# EasyEDA Pro project ProPrj_esp32_pressure_sensor_2026-01-26.epro

# Schematic Main_Schematic
Board Name: ESP32_Pressure_Sensor; Create Date: 2026-01-04; Page Name: P1; Project Name: esp32_pressure_sensor; Schematic Name: Main_Schematic; Update Date: 2026-01-26; Company: EasyEDA.com; Page Size: A4; Version: V1.0
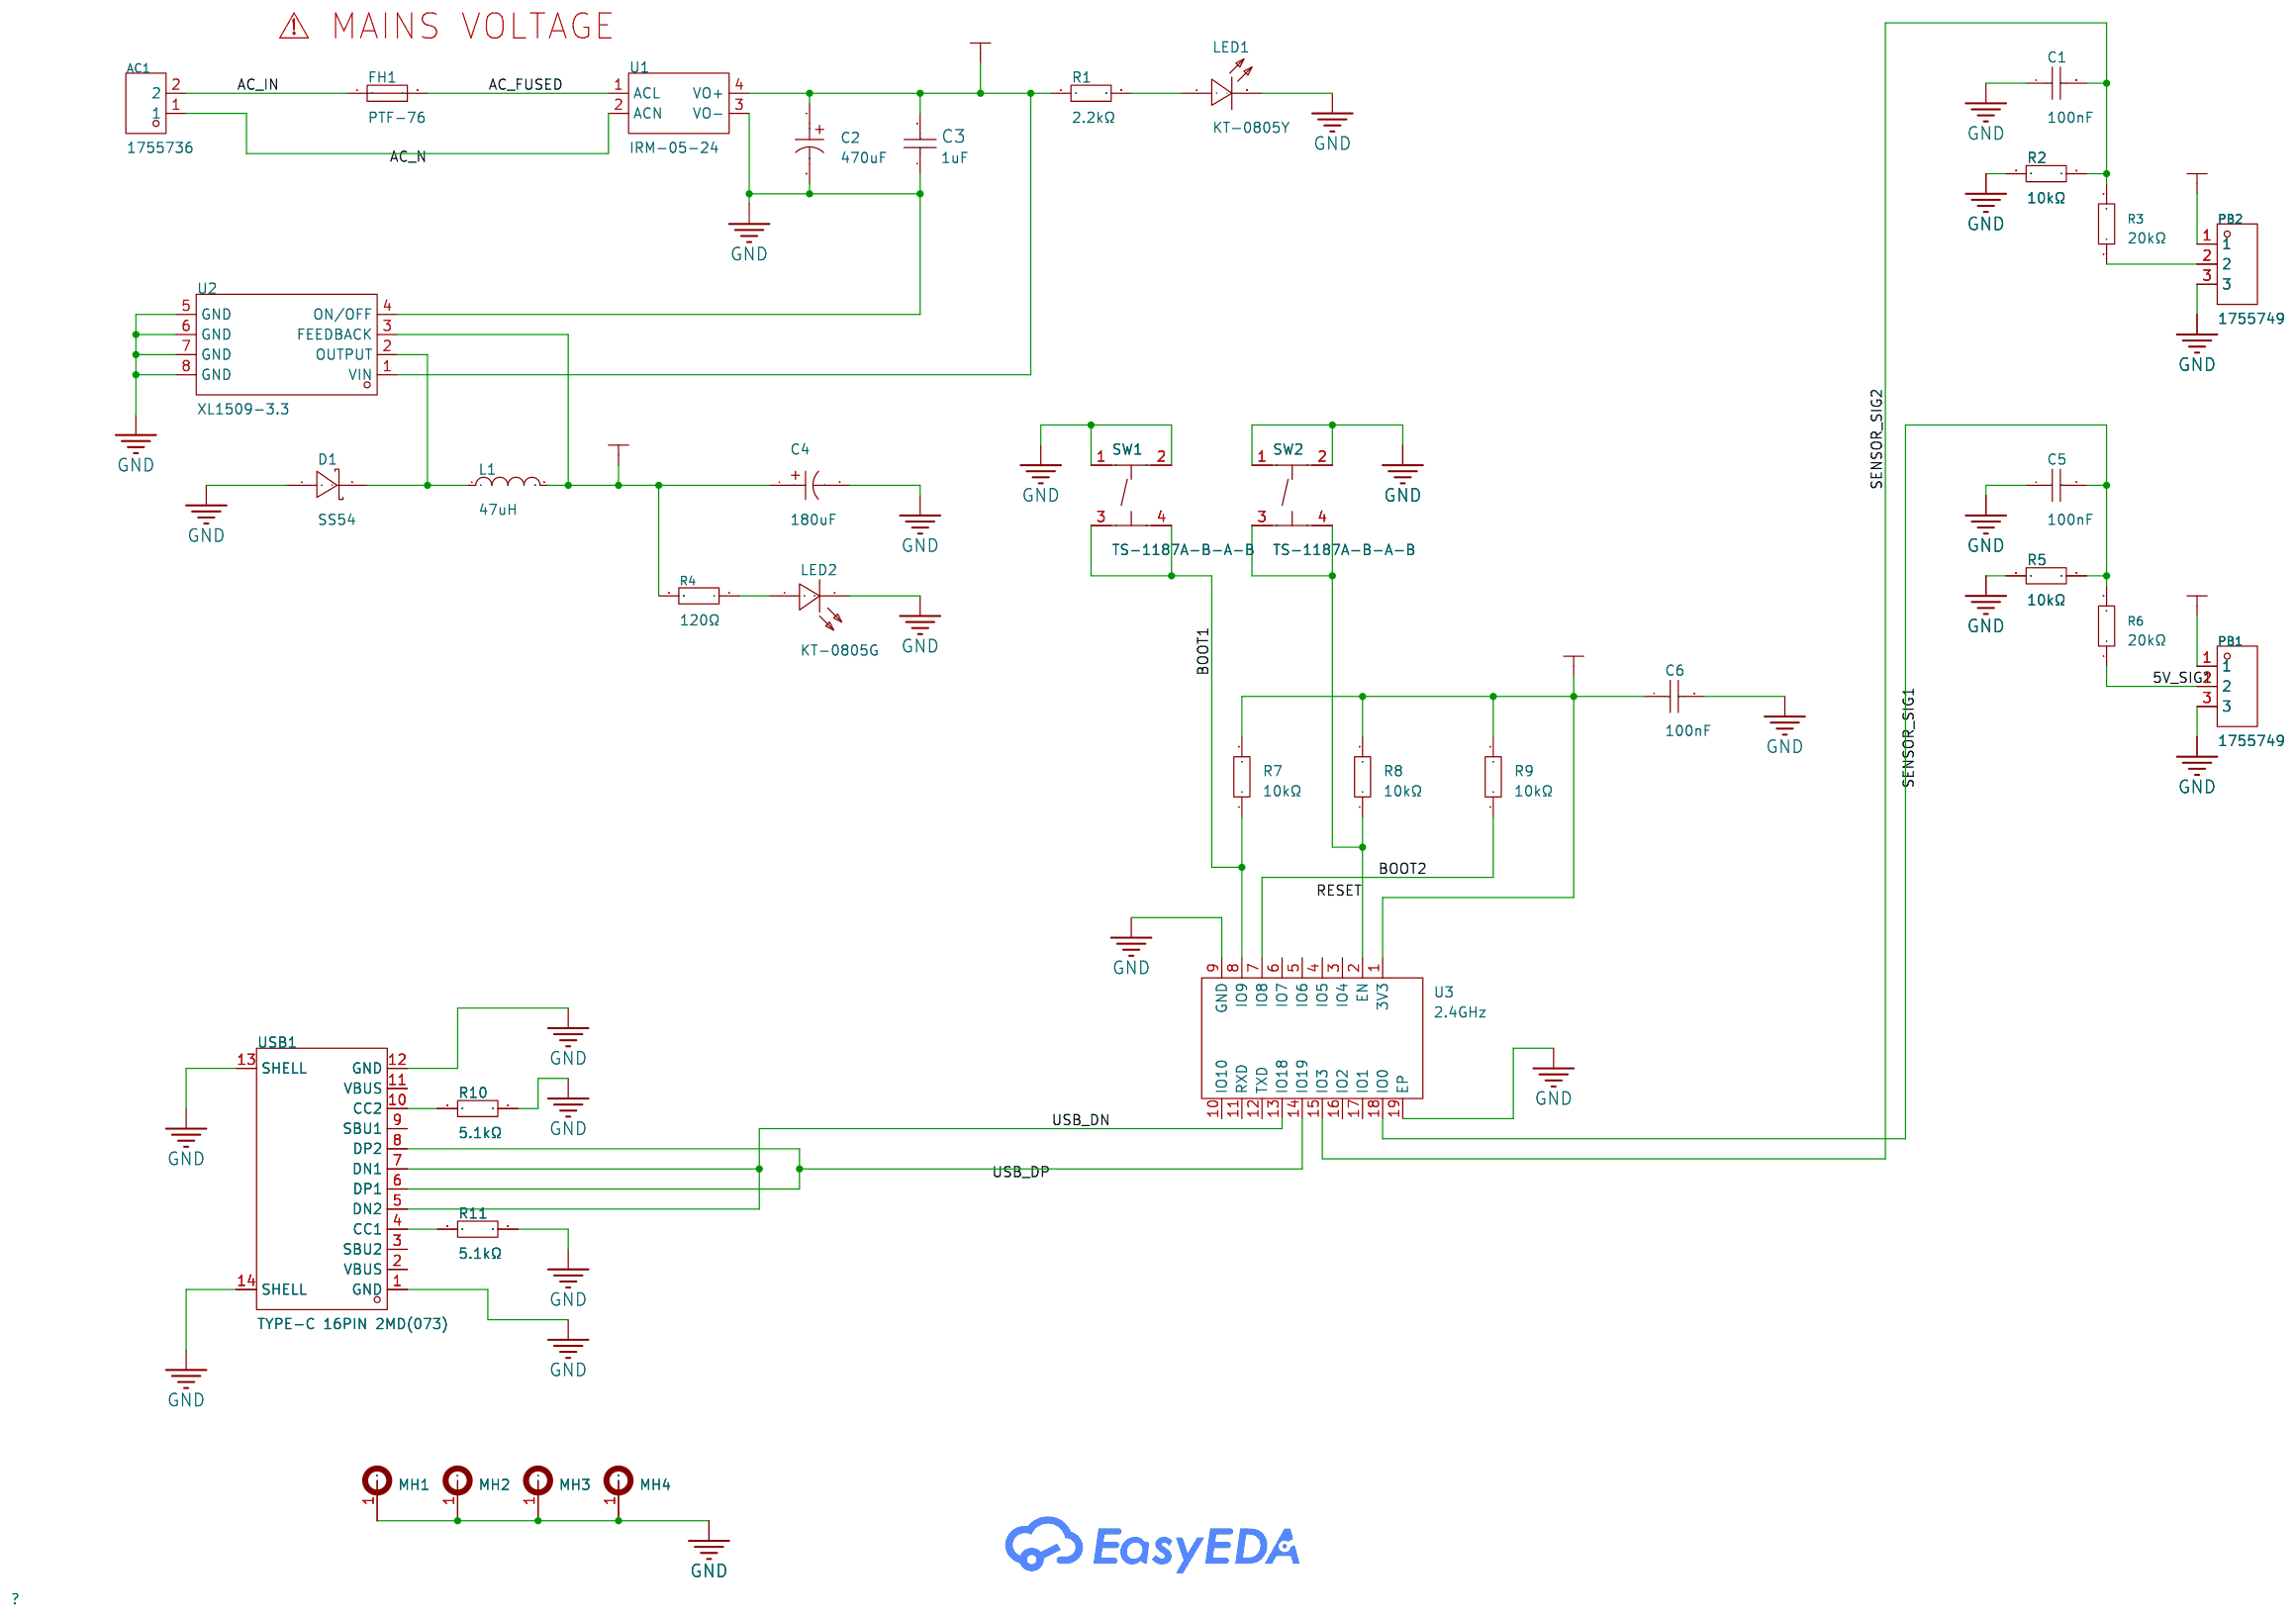
[diagram p0: schematic sheet]

## Parts
AC1  1755736  [CONN-TH_1755736]
C1  100nF  [C0805]
C2  470uF  [CAP-SMD_BD10.0-L10.3-W10.3-LS11.0-FD]
C3  1uF  [C0805]
C4  180uF  [CAP-SMD_BD6.3-L6.6-W6.6-LS7.4-FD]
C5  100nF  [C0805]
C6  100nF  [C0805]
D1  SS54  [SMA_L4.4-W2.8-LS5.4-R-RD]
FH1  PTF-76  [FUSE-TH_L25.2-W9.8_PTF-76]
L1  47uH  [IND-SMD_L4.5-W4.0]
LED1  KT-0805Y  [LED0805-R-RD]
LED2  KT-0805G  [LED0805-R-RD]
MH1  -  [MH_7.5x2.7mm]  (no BOM)
MH2  -  [MH_7.5x2.7mm]  (no BOM)
MH3  -  [MH_7.5x2.7mm]  (no BOM)
MH4  -  [MH_7.5x2.7mm]  (no BOM)
PB1  1755749  [CONN-TH_1755749]
PB2  1755749  [CONN-TH_1755749]
R1  2.2kΩ  [R0805]
R2  10kΩ  [R0805]
R3  20kΩ  [R0805]
R4  120Ω  [R0805]
R5  10kΩ  [R0805]
R6  20kΩ  [R0805]
R7  10kΩ  [R0805]
R8  10kΩ  [R0805]
R9  10kΩ  [R0805]
R10  5.1kΩ  [R0805]
R11  5.1kΩ  [R0805]
SW1  TS-1187A-B-A-B  [SW-SMD_4P-L5.1-W5.1-P3.70-LS6.5-TL_H1.5]
SW2  TS-1187A-B-A-B  [SW-SMD_4P-L5.1-W5.1-P3.70-LS6.5-TL_H1.5]
U1  IRM-05-24  [PWRM-TH_IRM-05-XX]
U2  XL1509-3.3  [SOIC-8_L4.9-W3.9-P1.27-LS6.0-BL]
U3  2.4GHz  [BULETM-SMD_ESPRESSIF_ESP32-C3-WROOM-02-N4-4MB]
USB1  TYPE-C 16PIN 2MD(073)  [USB-C-SMD_TYPE-C-6PIN-2MD-073]

## Library data of the parts
AC1 = 1755736: Connector Type:Board Side/Socket - Closed Number of Positions or Pins:1x2P Pitch:5.08mm Color:Green Mounting Type:Straight Pin Number of Pins:2P Number of Rows:1 Number of PINs Per Row:2 Current Rating:12A Voltage Rating (Max):250V Operating Temperature:-; LCSC Part Name: 5.08mm 1x2P 排数:1 每排P数:2; Supplier Part: C480503; Manufacturer: Phoenix Contact(菲尼克斯); Supplier Footprint: 插件,P=5.08mm; JLCPCB Part Class: Extended Part; Datasheet: https://item.szlcsc.com/datasheet/1755736/487889.html; Supplier: LCSC; Connector Type: Board Side/Socket - Closed; Number of Positions or Pins: 1x2P; Pitch: 5.08mm; Color: Green; Mounting Type: Straight Pin; Number of Pins: 2P; Number of Rows: 1; Number of PINs Per Row: 2; Current Rating: 12A; Voltage Rating (Max): 250V; Standardization Check: true
C1 C5 C6 = CL21B104KCFNNNE: Capacitance:100nF Tolerance:±10% Tolerance:±10% Voltage Rating:100V Temperature Coefficient:X7R; LCSC Part Name: 100nF ±10% 100V; Supplier Part: C28233; Manufacturer: SAMSUNG(三星); Supplier Footprint: 0805; JLCPCB Part Class: Basic Part; Datasheet: https://item.szlcsc.com/datasheet/CL21B104KCFNNNE/28983.html; Supplier: LCSC; Tolerance: ±10%; Voltage Rating: 100V; Temperature Coefficient: X7R; Standardization Check: true
C2 = JVE25V470M10X10: Capacitance:470uF Tolerance:±20% Tolerance:±20% Voltage Rating:25V Ripple Current:670mA@100KHz Equivalent Series Resistance(ESR):150mΩ@100KHz Diameter:10mm Height - Seated (Max):10.5mm Lifetime:2000hrs@105℃ Operating Temperature:-55℃~+105℃ Operating Tempe; LCSC Part Name: 470uF ±20% 25V; Supplier Part: C48615124; Manufacturer: JIERR(捷而瑞); Supplier Footprint: SMD,D10xL10.5mm; JLCPCB Part Class: Extended Part; Datasheet: https://item.szlcsc.com/datasheet/JVE25V470M10X10/50891418.html; Supplier: LCSC; Tolerance: ±20%; Voltage Rating: 25V; Ripple Current: 670mA@100KHz; Equivalent Series Resistance(ESR): 150mΩ@100KHz; Diameter: 10mm; Height - Seated (Max): 10.5mm; Lifetime: 2000hrs@105℃; Operating Temperature: -55℃~+105℃; Standardization Check: true
C3 = CL21B105KBFNNNE: Capacitance:1uF Tolerance:±10% Tolerance:±10% Voltage Rating:50V Temperature Coefficient:X7R; LCSC Part Name: 1uF ±10% 50V; Supplier Part: C28323; Manufacturer: SAMSUNG(三星); Supplier Footprint: 0805; JLCPCB Part Class: Basic Part; Datasheet: https://item.szlcsc.com/datasheet/CL21B105KBFNNNE/29074.html; Supplier: LCSC; Tolerance: ±10%; Voltage Rating: 50V; Temperature Coefficient: X7R; Standardization Check: true
C4 = RVT25V180M6X8: Capacitance:180uF Tolerance:±20% Tolerance:±20% Voltage Rating:25V Diameter:6.3mm Height - Seated (Max):7.7mm Lifetime:2000hrs@105℃ Operating Temperature:-40℃~+105℃ Operating Temperature:-40℃~+105℃; LCSC Part Name: 180uF ±20% 25V; Supplier Part: C49233128; Manufacturer: JIERR(捷而瑞); Supplier Footprint: SMD,D6.3xL7.7mm; JLCPCB Part Class: Extended Part; Datasheet: https://item.szlcsc.com/datasheet/RVT25V180M6X8/51648266.html; Supplier: LCSC; Tolerance: ±20%; Voltage Rating: 25V; Diameter: 6.3mm; Height - Seated (Max): 7.7mm; Lifetime: 2000hrs@105℃; Operating Temperature: -40℃~+105℃; Standardization Check: true
D1 = SS54_C22452: Diode Configuration:Independent Voltage - Forward(Vf@If):550mV@5A Voltage - DC Reverse(Vr):40V Current - Rectified:5A Reverse Leakage Current (Ir):1mA@40V Operating Junction Temperature Range:-55℃~+125℃ Operating Junction Temperature Range:-55℃~+125℃; LCSC Part Name: 电压:40V 电流:5A; Supplier Part: C22452; Manufacturer: MDD(辰达半导体); Supplier Footprint: SMA(DO-214AC); JLCPCB Part Class: Basic Part; Datasheet: https://item.szlcsc.com/datasheet/SS54/23178.html; Supplier: LCSC; Diode Configuration: Independent; Voltage - Forward(Vf@If): 550mV@5A; Voltage - DC Reverse(Vr): 40V; Current - Rectified: 5A; Reverse Leakage Current (Ir): 1mA@40V; Operating Junction Temperature Range: -55℃~+125℃; Standardization Check: true
FH1 = PTF-76: Fuseholder Type:Bracket type Number of Circuits:1 Voltage Rating:250V Current Rating:15A Fuse Type:Cylindrical Fuse Diameter (φD):5mm Fuse Length:20mm; LCSC Part Name: 两件套 保险丝夹5*20绿色（两件套）; Supplier Part: C22465956; Manufacturer: XFCN(兴飞); Supplier Footprint: 插件,P=14mm; JLCPCB Part Class: Extended Part; Datasheet: https://item.szlcsc.com/datasheet/PTF-76/24163098.html; Supplier: LCSC; Fuseholder Type: Bracket type; Number of Circuits: 1; Voltage Rating: 250V; Current Rating: 15A; Fuse Type: Cylindrical; Fuse Diameter (φD): 5mm; Fuse Length: 20mm; Standardization Check: true
L1 = CY43-47UH: Inductance:47uH Tolerance:±10% Tolerance:±10% Current Rating:500mA Current - Saturation (Isat):- DC Resistance(DCR):820mΩ Q @ Frequency:- Frequency - Self Resonant:- Ratings:- Type:-; LCSC Part Name: 47uH ±10%; Supplier Part: C2929422; Manufacturer: SHOU HAN(首韩); Supplier Footprint: SMD,4.5x4mm; JLCPCB Part Class: Extended Part; Datasheet: https://item.szlcsc.com/datasheet/CY43-47UH/3264904.html; Supplier: LCSC; Tolerance: ±10%; Current Rating: 500mA; DC Resistance(DCR): 820mΩ; Standardization Check: true
LED1 = KT-0805Y: Illumination Color:Yellow Voltage - Forward(Vf):1.8V~2.4V Voltage - Forward(Vf):1.8V~2.4V Power(Watts):40mW Forward Current:- Wavelength - Dominant:584nm~594nm Wavelength - Dominant:584nm~594nm Peak Wavelength:596nm Diode Configuration:- Lens Color:Water; LCSC Part Name: 0805 黄灯 高亮; Supplier Part: C2296; Manufacturer: KENTO; Supplier Footprint: 0805; JLCPCB Part Class: Basic Part; Datasheet: https://item.szlcsc.com/datasheet/KT-0805Y/2669.html; Supplier: LCSC; Illumination Color: Yellow; Voltage - Forward(Vf): 1.8V~2.4V; Power(Watts): 40mW; Wavelength - Dominant: 584nm~594nm; Peak Wavelength: 596nm; Lens Color: Water Clear; Luminous Intensity: 175mcd; Viewing Angle: 120°; Operating Temperature: -40℃~+85℃; Standardization Check: true
LED2 = KT-0805G: Lamp Holder Type:- Illumination Color:Emerald Green Voltage - Forward(Vf):2.6V~3.1V Voltage - Forward(Vf):2.6V~3.1V Power(Watts):100mW Forward Current:5mA Wavelength - Dominant:513nm~528nm Wavelength - Dominant:513nm~528nm Peak Wavelength:525nm Diode Conf; LCSC Part Name: 0805 翠绿 高亮; Supplier Part: C2297; Manufacturer: KENTO; Supplier Footprint: 0805; JLCPCB Part Class: Basic Part; Datasheet: https://item.szlcsc.com/datasheet/KT-0805G/2670.html; Supplier: LCSC; Illumination Color: Emerald Green; Voltage - Forward(Vf): 2.6V~3.1V; Power(Watts): 100mW; Forward Current: 5mA; Wavelength - Dominant: 513nm~528nm; Peak Wavelength: 525nm; Luminous Intensity: 430mcd; Viewing Angle: 120°; Operating Temperature: -40℃~+85℃; Standardization Check: true
MH1-MH4 = MH_7.5x2.7mm: Standardization Check: true
PB1 PB2 = 1755749: Connector Type:Board Side/Socket - Closed Number of Positions or Pins:1x3P Pitch:5.08mm Color:Green Mounting Type:Straight Pin Number of Pins:3P Number of Rows:1 Number of PINs Per Row:3 Current Rating:12A Voltage Rating (Max):250V Operating Temperature:-; LCSC Part Name: 5.08mm 1x3P 排数:1 每排P数:3; Supplier Part: C480509; Manufacturer: Phoenix Contact(菲尼克斯); Supplier Footprint: 插件,P=5.08mm; JLCPCB Part Class: Extended Part; Datasheet: https://item.szlcsc.com/datasheet/1755749/487895.html; Supplier: LCSC; Connector Type: Board Side/Socket - Closed; Number of Positions or Pins: 1x3P; Pitch: 5.08mm; Color: Green; Mounting Type: Straight Pin; Number of Pins: 3P; Number of Rows: 1; Number of PINs Per Row: 3; Current Rating: 12A; Voltage Rating (Max): 250V; Standardization Check: true
R1 = 0805W8F2201T5E_C17520: Type:Thick Film Resistor Resistance:2.2kΩ Tolerance:±1% Tolerance:±1% Power(Watts):125mW Voltage-Supply(Max):150V Temperature Coefficient:±100ppm/℃ Temperature Coefficient:±100ppm/℃ Operating Temperature:-55℃~+155℃ Operating Temperature:-55℃~+155℃; LCSC Part Name: 2.2kΩ ±1% 125mW 厚膜电阻; Supplier Part: C17520; Manufacturer: UNI-ROYAL(厚声); Manufacturer Part: 0805W8F2201T5E; Supplier Footprint: 0805; JLCPCB Part Class: Basic Part; Datasheet: https://item.szlcsc.com/datasheet/0805W8F2201T5E/18208.html; Supplier: LCSC; Type: Thick Film Resistor; Tolerance: ±1%; Power(Watts): 125mW; Voltage-Supply(Max): 150V; Temperature Coefficient: ±100ppm/℃; Operating Temperature: -55℃~+155℃; Standardization Check: true
R2 R5 R7-R9 = 0805W8F1002T5E: Type:Thick Film Resistor Resistance:10kΩ Tolerance:±1% Tolerance:±1% Power(Watts):125mW Voltage-Supply(Max):150V Temperature Coefficient:±100ppm/℃ Temperature Coefficient:±100ppm/℃ Operating Temperature:-55℃~+155℃ Operating Temperature:-55℃~+155℃; LCSC Part Name: 10kΩ ±1% 125mW 厚膜电阻; Supplier Part: C17414; Manufacturer: UNI-ROYAL(厚声); Supplier Footprint: 0805; JLCPCB Part Class: Basic Part; Datasheet: https://item.szlcsc.com/datasheet/0805W8F1002T5E/18102.html; Supplier: LCSC; Type: Thick Film Resistor; Tolerance: ±1%; Power(Watts): 125mW; Voltage-Supply(Max): 150V; Temperature Coefficient: ±100ppm/℃; Operating Temperature: -55℃~+155℃; Standardization Check: true
R3 R6 = 0805W8F2002T5E: Type:Thick Film Resistors Resistance:20kΩ Tolerance:±1% Tolerance:±1% Power(Watts): Overload Voltage (Max): Temperature Coefficient:±100ppm/℃ Temperature Coefficient:±100ppm/℃ Operating Temperature Range:-55℃~+155℃ Operating Temperature Range:-55℃~+155℃; LCSC Part Name: 20kΩ ±1% 125mW 厚膜电阻; Supplier Part: C4328; Manufacturer: UNI-ROYAL(厚声); Supplier Footprint: 0805; JLCPCB Part Class: Basic Part; Datasheet: https://atta.szlcsc.com/upload/public/pdf/source/20200306/C422600_1E6D84923E4A46A82E41ADD87F860B5C.pdf; Supplier: LCSC; Type: Thick Film Resistors; Tolerance: ±1%; Temperature Coefficient: ±100ppm/℃; Operating Temperature Range: -55℃~+155℃; Standardization Check: true
R4 = 0805W8F1200T5E: Type:Thick Film Resistors Resistance: Tolerance:±1% Tolerance:±1% Power(Watts): Overload Voltage (Max): Temperature Coefficient:±100ppm/℃ Temperature Coefficient:±100ppm/℃ Operating Temperature Range:-55℃~+155℃ Operating Temperature Range:-55℃~+155℃; LCSC Part Name: 120Ω ±1% 125mW 厚膜电阻; Supplier Part: C17437; Manufacturer: UNI-ROYAL(厚声); Supplier Footprint: 0805; JLCPCB Part Class: Basic Part; Datasheet: https://atta.szlcsc.com/upload/public/pdf/source/20200306/C422600_1E6D84923E4A46A82E41ADD87F860B5C.pdf; Supplier: LCSC; Type: Thick Film Resistors; Tolerance: ±1%; Temperature Coefficient: ±100ppm/℃; Operating Temperature Range: -55℃~+155℃; Standardization Check: true
R10 R11 = 0805W8F5101T5E: Type:Thick Film Resistor Resistance:5.1kΩ Tolerance:±1% Tolerance:±1% Power(Watts):125mW Voltage-Supply(Max):150V Temperature Coefficient:±100ppm/℃ Temperature Coefficient:±100ppm/℃ Operating Temperature:-55℃~+155℃ Operating Temperature:-55℃~+155℃; LCSC Part Name: 5.1kΩ ±1% 125mW 厚膜电阻; Supplier Part: C27834; Manufacturer: UNI-ROYAL(厚声); Supplier Footprint: 0805; JLCPCB Part Class: Basic Part; Datasheet: https://item.szlcsc.com/datasheet/0805W8F5101T5E/28584.html; Supplier: LCSC; Type: Thick Film Resistor; Tolerance: ±1%; Power(Watts): 125mW; Voltage-Supply(Max): 150V; Temperature Coefficient: ±100ppm/℃; Operating Temperature: -55℃~+155℃; Standardization Check: true
SW1 SW2 = TS-1187A-B-A-B: Circuit:SPST Actuator Style:Round Button Operating Force:1.6N Mounting Type:Surface Mount,Vertical Length:5.1mm Width:5.1mm Switch Height:1.5mm with Bracket:Without Bracket Contact Current:50mA Voltage Rating:12V Actuator/Cap Color:Gold With Lamp:No Life:; LCSC Part Name: 5.1*5.1*1.5mm 立贴 轻触开关; Supplier Part: C318884; Manufacturer: XKB Connection(中国星坤); Supplier Footprint: SMD; JLCPCB Part Class: Basic Part; Datasheet: https://item.szlcsc.com/datasheet/TS-1187A-B-A-B/299976.html; Supplier: LCSC; Circuit: SPST; Actuator Style: Round Button; Operating Force: 1.6N; Mounting Type: Surface Mount,Vertical; Length: 5.1mm; Width: 5.1mm; Switch Height: 1.5mm; with Bracket: Without Bracket; Contact Current: 50mA; Voltage Rating: 12V; Actuator/Cap Color: Gold; With Lamp: No; Life: 100,000 Cycles; Operating Temperature: -30℃~+85℃; Standardization Check: true
U1 = IRM-05-24: LCSC Part Name: MW(明纬) 单输出封装型PCB安装型胶囊型绿色模块开关电源 AC-DC 5W IRM-05-24; Supplier Part: C5741325; Manufacturer: MW(明纬); Supplier Footprint: DIP,45.7x25.4mm; JLCPCB Part Class: Extended Part; Datasheet: https://item.szlcsc.com/datasheet/IRM-05-24/6667043.html; Supplier: LCSC; Standardization Check: true
U2 = XL1509-3.3: Function:Buck Voltage - Supply:4.5V~40V Voltage - Supply:4.5V~40V Output Voltage:3.3V Output Voltage:3.3V Output Current:2A Frequency - Switching:150kHz Frequency - Switching:150kHz Operating Temperature:-40℃~+125℃@(TJ) Operating Temperature:-40℃~+125℃@(T; LCSC Part Name: 150 KHz 固定频率 PWM 降压 DC/DC 转换器; Supplier Part: C2681226; Manufacturer: UMW(友台半导体); Supplier Footprint: SOP-8; JLCPCB Part Class: Extended Part; Datasheet: https://item.szlcsc.com/datasheet/XL1509-3.3/2773702.html; Supplier: LCSC; Function: Buck; Voltage - Supply: 4.5V~40V; Output Voltage: 3.3V; Output Current: 2A; Frequency - Switching: 150kHz; Operating Temperature: -40℃~+125℃@(TJ); Synchronous Rectifier: No; Number of Outputs: 1; Topology: Buck; Quiescent Current: 2mA; Switch tube (built-in/external): Built-In; Output Type: Fixed; Standardization Check: true
U3 = ESP32-C3-WROOM-02-N4_C2934560: Utilized IC / Part:ESP32-C3 Chip Wireless Standard:Bluetooth5.0 Interface Type:I2S；I2C；JTAG；UART；USB；SPI Frequency:2.4GHz Antenna Type:On-board PCB Antenna Output Power:20.5dBm Output Power:20.5dBm Voltage - Supply:3V~3.6V Voltage - Supply:3V~3.6V Receive; LCSC Part Name: ESP32-C3-WROOM-02-N4; Supplier Part: C2934560; Manufacturer: ESPRESSIF(乐鑫); Manufacturer Part: ESP32-C3-WROOM-02-N4; Supplier Footprint: VFQFN-32-EP; JLCPCB Part Class: Extended Part; Datasheet: https://item.szlcsc.com/datasheet/ESP32-C3-WROOM-02-N4/3281215.html; Supplier: LCSC; Utilized IC / Part: ESP32-C3 Chip; Wireless Standard: Bluetooth5.0; Interface Type: I2S；I2C；JTAG；UART；USB；SPI; Antenna Type: On-board PCB Antenna; Output Power: 20.5dBm; Voltage - Supply: 3V~3.6V; Receive  Current: 82mA; Send  Current: 345mA; Sensitivity: -98dBm; Operating Temperature: -40℃~+85℃; Standardization Check: true
USB1 = TYPE-C 16PIN 2MD(073): Connector Type:Type-C Protocol Standard:- Gender:Female Mounting Type:Surface Mount, Right Angle Number of Contacts:16P Number of Ports:1 Current Rating-Power:3A Voltage Rating:5V Connect-Disconnect Life:5,000 Cycles Supplementary Features:- Center Height; LCSC Part Name: Type-C 母 卧贴; Supplier Part: C2765186; Manufacturer: SHOU HAN(首韩); Supplier Footprint: SMD; JLCPCB Part Class: Extended Part; Datasheet: https://item.szlcsc.com/datasheet/TYPE-C%252016PIN%25202MD(073)/2901843.html; Supplier: LCSC; Connector Type: Type-C; Gender: Female; Mounting Type: Surface Mount, Right Angle; Number of Contacts: 16P; Number of Ports: 1; Current Rating-Power: 3A; Voltage Rating: 5V; Connect-Disconnect Life: 5,000 Cycles; Detection color: Black; Operating Temperature: -25℃~+85℃; Standardization Check: true

## Nets
3.3V_LED_PW: LED2.1(A) R4.1
5V_SIG1: PB1.2 R6.1
5V_SIG2: PB2.2 R3.1
24V_LED_PW: LED1.1(+) R1.2
+3.3V: C4.1 C6.1 L1.2 R4.2 R7.2 R8.2 R9.2 U2.3(FEEDBACK) U3.1(3V3)
+24V: C2.1 C3.2 PB1.1 PB2.1 R1.1 U1.4(VO+) U2.1(VIN)
GND: C1.1 C2.2 C3.1 C4.2 C5.1 C6.2 D1.1(A) LED1.2(-) LED2.2(K) MH1.1 MH2.1 MH3.1 MH4.1 PB1.3 PB2.3 R2.2 R5.2 R10.1 R11.1 SW1.1(A) SW1.2(B) SW2.1(A) SW2.2(B) U1.3(VO-) U2.4(ON/OFF) U2.5(GND) U2.6(GND) U2.7(GND) U2.8(GND) U3.9(GND) U3.19(EP) USB1.1(GND) USB1.12(GND) USB1.13(SHELL) USB1.14(SHELL)
AC_FUSED: FH1.2 U1.1(ACL)
AC_IN: AC1.2 FH1.1
AC_N: AC1.1 U1.2(ACN)
BOOT1: R7.1 SW1.3(C) SW1.4(D) U3.8(IO9)
BOOT2: R9.1 U3.7(IO8)
CC1: R11.2 USB1.4(CC1)
CC2: R10.2 USB1.10(CC2)
RESET: R8.1 SW2.3(C) SW2.4(D) U3.2(EN)
SENSOR_SIG1: C5.2 R5.1 R6.2 U3.18(IO0)
SENSOR_SIG2: C1.2 R2.1 R3.2 U3.15(IO3)
USB_DN: U3.13(IO18) USB1.5(DN2) USB1.7(DN1)
USB_DP: U3.14(IO19) USB1.6(DP1) USB1.8(DP2)
$1N3109: D1.2(K) L1.1 U2.2(OUTPUT)

Not connected (* = marked no-connect by the designer): U3 3(IO4) 4(IO5) 5(IO6) 6(IO7) 10(IO10) 11(RXD) 12(TXD) 16(IO2) 17(IO1); USB1 2(VBUS) 3(SBU2) 9(SBU1) 11(VBUS)

## Notes on the sheet
- ⚠️ MAINS VOLTAGE

# Board Main_PCB
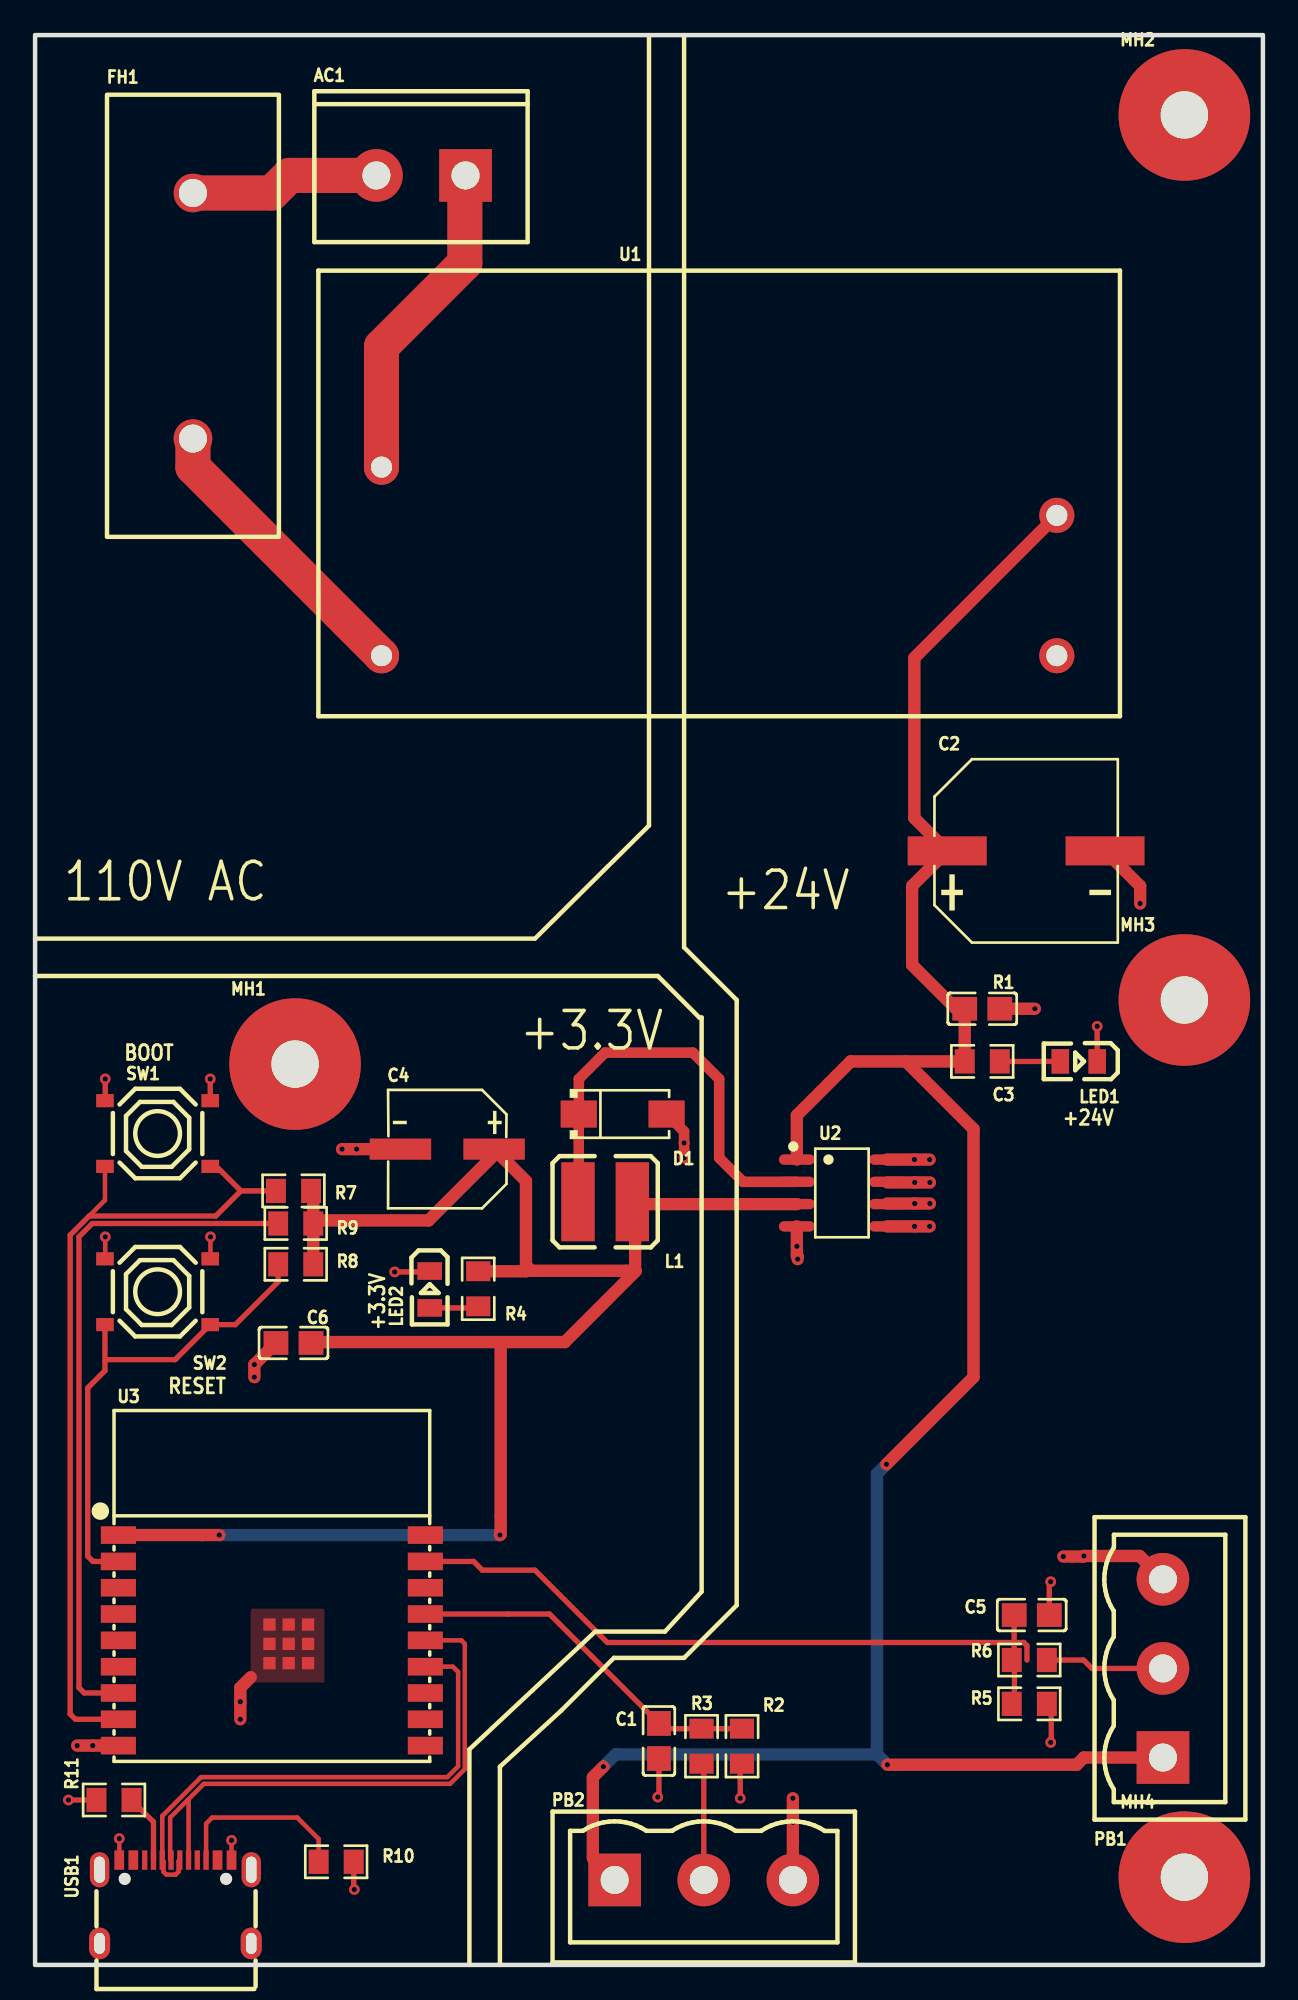
[diagram p1: board, top side]
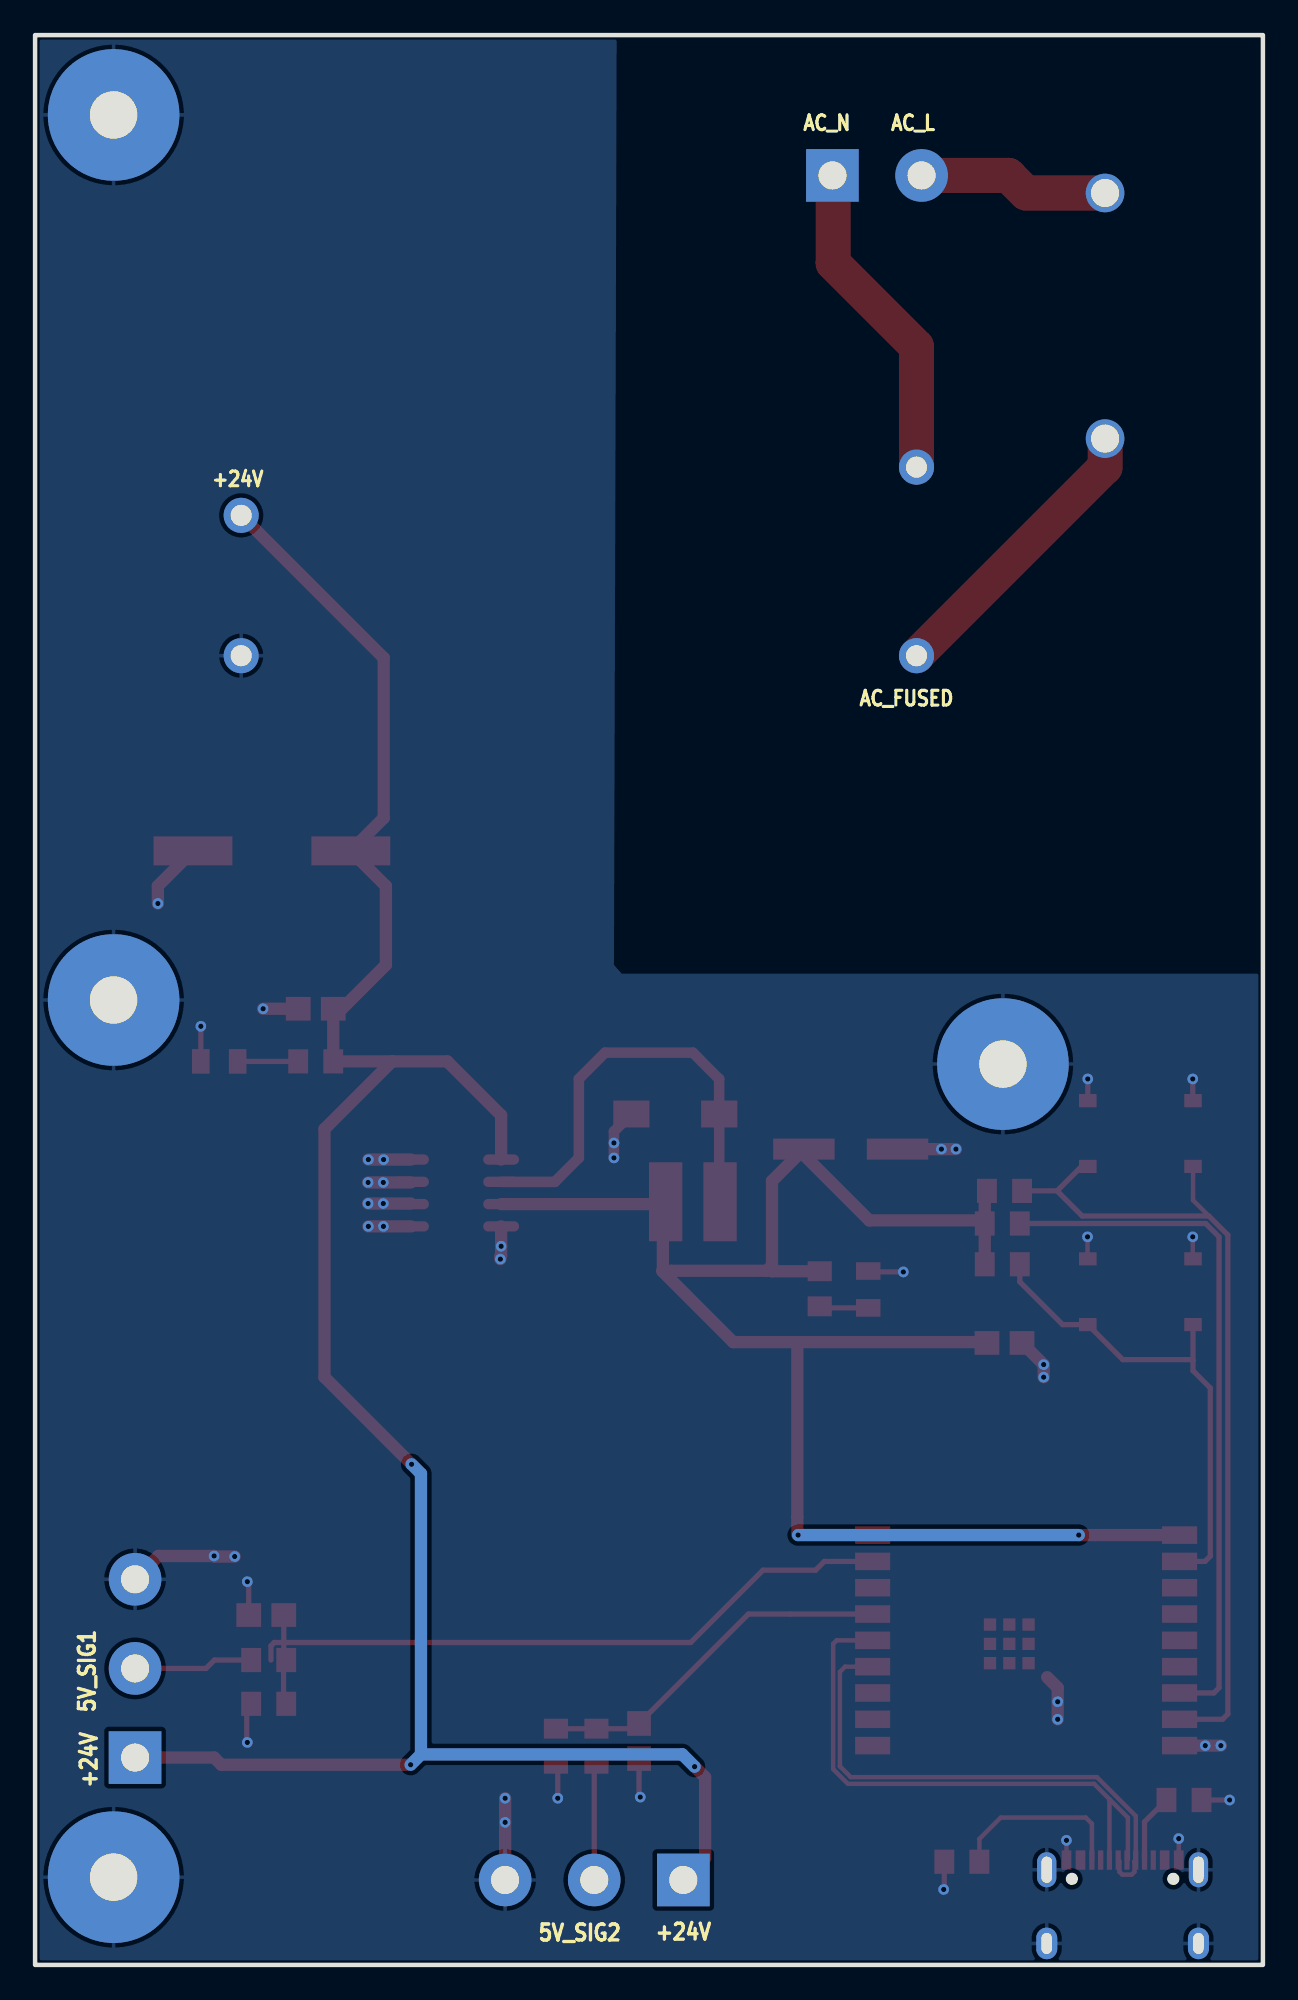
[diagram p2: board, bottom side, seen from below]

Outline 70 x 110 mm; copper layers: Top Layer, Bottom Layer. Coordinates in mm from the lower left corner of the outline.
Outline path: rectangle 0,110 70,0
Stack: Top Layer 0.035mm / Dielectric1 1.51mm FR4 er 4.5 / Bottom Layer 0.035mm

## Design rules (mm)
template: Custom Config
spacing copperThickness1oz (default): track to track 0.127, other pairs 0.152 to 0.3
spacing copperThickness2oz: track to track 0.203, other pairs 0.152 to 0.3
track width copperThickness1oz (default): min 0.127, default 0.254, max 2.54
track width copperThickness2oz: min 0.203, default 0.254, max 2.54
differential pair differentialPair (default): width min 0.127, default 0.254, max 2.54; gap min 0.152, default 0.152
via viaSize (default): diameter min 0.5, default 0.61, max 10; hole min 0.3, default 0.305, max 6.3

## Placement (name value [footprint] x y rotation side)
AC1  1755736  [CONN-TH_1755736]  22 102 180 top
C1  100nF  [C0805]  35.57 12.76 90 top
C2  470uF  [CAP-SMD_BD10.0-L10.3-W10.3-LS11.0-FD]  56.5 63.5 0 top
C3  1uF  [C0805]  54 54.5 180 top
C4  180uF  [CAP-SMD_BD6.3-L6.6-W6.6-LS7.4-FD]  23.5 46.5 180 top
C5  100nF  [C0805]  56.82 19.94 180 top
C6  100nF  [C0805]  14.73 35.45 180 top
D1  SS54  [SMA_L4.4-W2.8-LS5.4-R-RD]  33.5 48.5 0 top
FH1  PTF-76  [FUSE-TH_L25.2-W9.8_PTF-76]  9 94 270 top
L1  47uH  [IND-SMD_L4.5-W4.0]  32.5 43.5 0 top
LED1  KT-0805Y  [LED0805-R-RD]  59.5 51.5 180 top
LED2  KT-0805G  [LED0805-R-RD]  22.5 38.5 270 top
MH1  -  [MH_7.5x2.7mm]  14.82 51.35 0 top
MH2  -  [MH_7.5x2.7mm]  65.52 105.45 0 top
MH3  -  [MH_7.5x2.7mm]  65.52 55 0 top
MH4  -  [MH_7.5x2.7mm]  65.52 5 0 top
PB1  1755749  [CONN-TH_1755749]  64.3 16.9 90 top
PB2  1755749  [CONN-TH_1755749]  38.12 4.84 0 top
R1  2.2kΩ  [R0805]  54 51.5 0 top
R2  10kΩ  [R0805]  40.3 12.47 270 top
R3  20kΩ  [R0805]  38 12.47 90 top
R4  120Ω  [R0805]  25.26 38.54 90 top
R5  10kΩ  [R0805]  56.68 14.88 0 top
R6  20kΩ  [R0805]  56.68 17.38 180 top
R7  10kΩ  [R0805]  14.73 44.12 0 top
R8  10kΩ  [R0805]  14.86 39.94 0 top
R9  10kΩ  [R0805]  14.86 42.26 0 top
R10  5.1kΩ  [R0805]  17.17 5.88 180 top
R11  5.1kΩ  [R0805]  4.5 9.4 0 top
SW1  TS-1187A-B-A-B  [SW-SMD_4P-L5.1-W5.1-P3.70-LS6.5-TL_H1.5]  6.98 47.39 0 top
SW2  TS-1187A-B-A-B  [SW-SMD_4P-L5.1-W5.1-P3.70-LS6.5-TL_H1.5]  6.98 38.37 0 top
U1  IRM-05-24  [PWRM-TH_IRM-05-XX]  39 80 0 top
U2  XL1509-3.3  [SOIC-8_L4.9-W3.9-P1.27-LS6.0-BL]  46 44 270 top
U3  2.4GHz  [BULETM-SMD_ESPRESSIF_ESP32-C3-WROOM-02-N4-4MB]  13.5 18.5 0 top
USB1  TYPE-C 16PIN 2MD(073)  [USB-C-SMD_TYPE-C-6PIN-2MD-073]  8 3.6 0 top

## Footprints (pads in the part's own frame, mm; a bottom-side part is the same pattern mirrored in y, then rotated)
BULETM-SMD_ESPRESSIF_ESP32-C3-WROOM-02-N4-4MB
  rect 2x1 smd: 1(-8.75,6) 2(-8.75,4.5) 3(-8.75,3) 4(-8.75,1.5) 5(-8.75,0) 6(-8.75,-1.5) 7(-8.75,-3) 8(-8.75,-4.5) 9(-8.75,-6) 10(8.75,-6) 11(8.75,-4.5) 12(8.75,-3) 13(8.75,-1.5) 14(8.75,0) 15(8.75,1.5) 16(8.75,3) 17(8.75,4.5) 18(8.75,6)
  rect 0.7x0.7 smd: 19(-0.14,0.9) 19(-0.14,-0.2) 19(-0.14,-1.3) 19(0.96,0.9) 19(0.96,-0.2) 19(0.96,-1.3) 19(2.06,0.9) 19(2.06,-0.2) 19(2.06,-1.3)
C0805
  rect 1.41x1.35 smd: 1(-1,0) 2(1,0)
CAP-SMD_BD6.3-L6.6-W6.6-LS7.4-FD
  rect 3.5x1.2 smd: 1(-2.67,0) 2(2.67,0)
CAP-SMD_BD10.0-L10.3-W10.3-LS11.0-FD
  rect 4.5x1.65 smd: 1(-4.5,0) 2(4.5,0)
CONN-TH_1755736
  rect 3x3 hole 1.6: 1(-2.54,0)
  round 3 hole 1.6: 2(2.54,0)
CONN-TH_1755749
  rect 3x3 hole 1.6: 1(-5.08,0)
  round 3 hole 1.6: 2(0,0) 3(5.08,0)
FUSE-TH_L25.2-W9.8_PTF-76
  round 2.2 hole 1.6: 1(-7,0) 2(7,0)
IND-SMD_L4.5-W4.0
  rect 1.9x4.5 smd: 1(-1.55,0) 2(1.55,0)
LED0805-R-RD
  rect 1x1.399 smd: 1(1.05,0) 2(-1.05,0)
MH_7.5x2.7mm
  round 7.5 hole 2.7: 1(0,0)
PWRM-TH_IRM-05-XX
  round 2 hole 1.2: 1(-19.25,-5.375) 2(-19.25,5.375) 3(19.25,-5.375) 4(19.25,2.625)
R0805
  rect 1.133x1.377 smd: 1(-1,0) 2(1,0)
SMA_L4.4-W2.8-LS5.4-R-RD
  rect 2.062x1.539 smd: 1(2.503,0) 2(-2.503,0)
SOIC-8_L4.9-W3.9-P1.27-LS6.0-BL
  oval 0.588x2.045 smd: 1(-1.905,-2.57) 2(-0.635,-2.57) 3(0.635,-2.57) 4(1.905,-2.57) 5(1.905,2.57) 6(0.635,2.57) 7(-0.635,2.57) 8(-1.905,2.57)
SW-SMD_4P-L5.1-W5.1-P3.70-LS6.5-TL_H1.5
  rect 1x0.75 smd: 1(-3,1.875) 2(3,1.875) 3(-3,-1.875) 4(3,-1.875)
USB-C-SMD_TYPE-C-6PIN-2MD-073
  rect 0.55x1.1 smd: 1(-3.2,2.375) 2(-2.4,2.375) 11(2.4,2.375) 12(3.2,2.375)
  rect 0.3x1.1 smd: 3(-1.75,2.375) 4(-1.25,2.375) 5(-0.75,2.375) 6(-0.25,2.375) 7(0.25,2.375) 8(0.75,2.375) 9(1.25,2.375) 10(1.75,2.375)
  oval 1.1x2 hole 0.6x1.5: 13(-4.325,1.825) 14(4.325,1.825)
  oval 1.2x1.8 hole 0.6x1.2: 13(-4.325,-2.375) 14(4.325,-2.375)

## Nets
As in the schematic.

Pads without a net: U3 3 4 5 6 10 11 12 16 17; USB1 2 3 9 11

## Via types
v1: diameter 0.61, hole 0.305, Top Layer to Bottom Layer, 45 vias

## Routing (per net, layer and track width the routed paths; a pad name or vN(x,y) marks a point on that pad's centre or on a via; arc(x,y) is an arc through that point)
3.3V_LED_PW: length 2.8
  Top Layer w0.3: R4.1 25.18,37.45 LED2.1
5V_SIG1: length 6.7
  Top Layer w0.3: PB1.2 60.25,16.9 59.77,17.38 57.83,17.38
5V_SIG2: length 6.7
  Top Layer w0.3: R3.1 38.12,11.34 PB2.2
24V_LED_PW: length 3.4
  Top Layer w0.3: R1.2 LED1.1
+3.3V: length 99.3
  Top Layer w0.7: 34.19,43.36 L1.2 ; 34.19,43.36 34.21,43.34 34.21,39.55 33.75,39.55 33.74,39.56 28.29,39.56 27.99,39.86 ; 34.19,43.36 U2.3 ; 27.99,39.86 27.99,44.68 C4.1 26.17,46.17 22.44,42.44 15.86,42.44 15.86,43.99 R7.2 ; 27.99,39.86 27.99,39.54 R4.2 ; v1(26.5,24.5) 26.54,24.54 26.54,35.5 ; 34.25,39.55 30.2,35.5 26.54,35.5 ; 26.54,35.5 15.78,35.5 C6.1 ; R9.2 R8.2 ; U3.1 v1(10.5,24.5)
  Bottom Layer w0.7: v1(26.5,24.5) v1(10.5,24.5)
+24V: length 134.2
  Top Layer w0.7: 49.64,51.5 46.5,51.5 43.43,48.43 U2.1 ; 49.64,51.5 R1.1 C3.2 52.5,54.5 50,57 50,61.5 C2.1 50.12,65.38 50.12,74.5 U1.4 ; 49.64,51.5 53.5,47.64 53.5,33.5 v1(48.54,28.54) ; PB2.1 31.8,6.08 31.8,10.7 v1(32.4,11.3) ; PB1.1 59.79,11.82 59.38,11.41 v1(48.59,11.41)
  Bottom Layer w0.7: 48,12 48,28 v1(48.54,28.54) ; 48,12 33.1,12 v1(32.4,11.3) ; 48,12 v1(48.59,11.41)
GND: length 65
  Top Layer w0.254: USB1.1 v1(4.8,7.2) ; SW2.2 10,40.26 v1(10,41.5) ; SW2.1 4,40.26 v1(4,41.5) ; USB1.12 v1(11.2,7.1)
  Top Layer w0.3: SW1.2 v1(9.98,50.5) ; C1.1 35.57,9.63 v1(35.5,9.57) ; v1(18.2,4.3) 18.17,4.33 R10.1 ; LED1.2 v1(60.55,53.5) ; C5.1 57.82,21.84 v1(57.9,21.84) ; R11.1 v1(1.9,9.4) ; v1(20.5,39.5) 22.45,39.5 LED2.2 ; 40.2,11.47 v1(40.2,9.5) ; 57.93,14.88 57.93,12.72 v1(57.9,12.68) ; v1(4,50.5) 4,49.28 SW1.1
  Top Layer w0.6: D1.1 37,47.5 v1(37,46.85) v1(37,46)
  Top Layer w0.7: v1(51,45.91) v1(50.13,45.91) U2.8 ; C6.2 v1(12.5,34.22) v1(12.5,33.5) ; C3.1 v1(57,54.5) ; U3.9 v1(3.29,12.5) v1(2.4,12.5) ; 12.3,16.4 11.7,15.8 v1(11.7,15) v1(11.7,14) ; PB1.3 62.97,23.31 v1(59.79,23.31) 59.76,23.28 v1(58.62,23.28) ; v1(51.01,44.6) v1(50.15,44.6) 48.59,44.6 ; U2.5 v1(50.14,42.09) v1(51,42.09) ; C4.2 v1(18.33,46.5) v1(17.5,46.5) ; U2.4 v1(43.43,40.96) 43.43,40.42 43.47,40.38 v1(43.47,40.23) ; PB2.3 v1(43.2,8.13) v1(43.2,9.5) ; 48.59,43.4 v1(50.15,43.4) v1(51.01,43.4) ; C2.2 63,61.5 v1(63,60.5)
(no net): length 42.2
  Top Layer w0.3: 55.82,18.38 55.82,17.39 55.83,17.38 55.83,14.98 55.93,14.88 ; 55.82,18.38 55.82,19.94 ; 55.82,18.38 32.62,18.38 28.5,22.5 25.5,22.5 25,23 U3.17 ; 55.82,18.38 56.36,18.38 56.55,18.19 56.55,17.38
AC_FUSED: length 16.8
  Top Layer w2: U1.1 9,85.38 FH1.2
AC_IN: length 10.9
  Top Layer w2: FH1.1 13.5,101 14.5,102 AC1.2
AC_N: length 18.6
  Top Layer w2: U1.2 19.75,92.25 24.5,97 24.5,101.96 AC1.1
BOOT1: length 48.5
  Top Layer w0.254: SW1.3 3.98,43.59 3.08,42.69
  Top Layer w0.3: R7.1 11.73,44.12 ; 11.73,44.12 10.3,42.69 3.08,42.69 2,41.6 2,14.3 2.3,14 U3.8 ; 11.73,44.12 10.34,45.51 SW1.4
BOOT2: length 39.7
  Top Layer w0.3: R9.1 3.26,42.26 2.5,41.5 2.5,15.8 2.8,15.5 U3.7
CC1: length 3.9
  Top Layer w0.3: R11.2 6.75,8.15 USB1.4
CC2: length 10.4
  Top Layer w0.254: USB1.10 9.75,8.05 10.1,8.4 14.94,8.4 16.17,7.18 R10.2
RESET: length 28.2
  Top Layer w0.3: 3.98,34.45 3.98,33.87 3,32.89 3,23.3 3.3,23 U3.2 ; 3.98,34.45 4.03,34.5 7.99,34.5 SW2.4 11.42,36.5 13.86,38.94 R8.1 ; 3.98,34.45 SW2.3
SENSOR_SIG2: length 20.7
  Top Layer w0.3: U3.15 29.33,20 35.86,13.47 R3.2 40.2,13.47
USB_DN: length 30.3
  Top Layer w0.254: U3.13 23.82,17 24.12,16.7 24.12,11.32 23.5,10.7 9.46,10.7 7.25,8.49 USB1.5 7.32,5.91 7.32,5.87 7.32,5.87 7.32,5.31 7.48,5.15 8.02,5.15 8.18,5.31 8.18,5.9 USB1.7
USB_DP: length 33.3
  Top Layer w0.254: USB1.6 7.7,6.03 7.7,8.4 8.71,9.41 ; 8.71,9.41 9.62,10.32 23.66,10.32 24.5,11.16 24.5,18.3 24.3,18.5 U3.14 ; 8.71,9.41 8.75,9.37 USB1.8
$1N3109: length 25.8
  Top Layer w0.6: L1.1 31,43.55 D1.2 31,48.5 31,50.5 32.5,52 37.5,52 39,50.5 39,46 40.37,44.64 U2.2

## Copper pours and planes (outline as drawn; the poured copper is in the pictures)
GND on Top Layer: 16.5,20.3 16.5,16.1 12.3,16.1 12.3,20.3
GND on Bottom Layer: 0,0 69.46,0 70,0.42 70,110 36.84,110 37,57 36.56,56.5 0,56.5

## Text on the board
Bottom Silkscreen Layer: AC_L | AC_FUSED | AC_N | +24V | 5V_SIG2 | 5V_SIG1
Top Silkscreen Layer: +24V | +3.3V | BOOT | RESET | 110V AC
